# EAGLE schematic node (EAGLE 7.3.0)
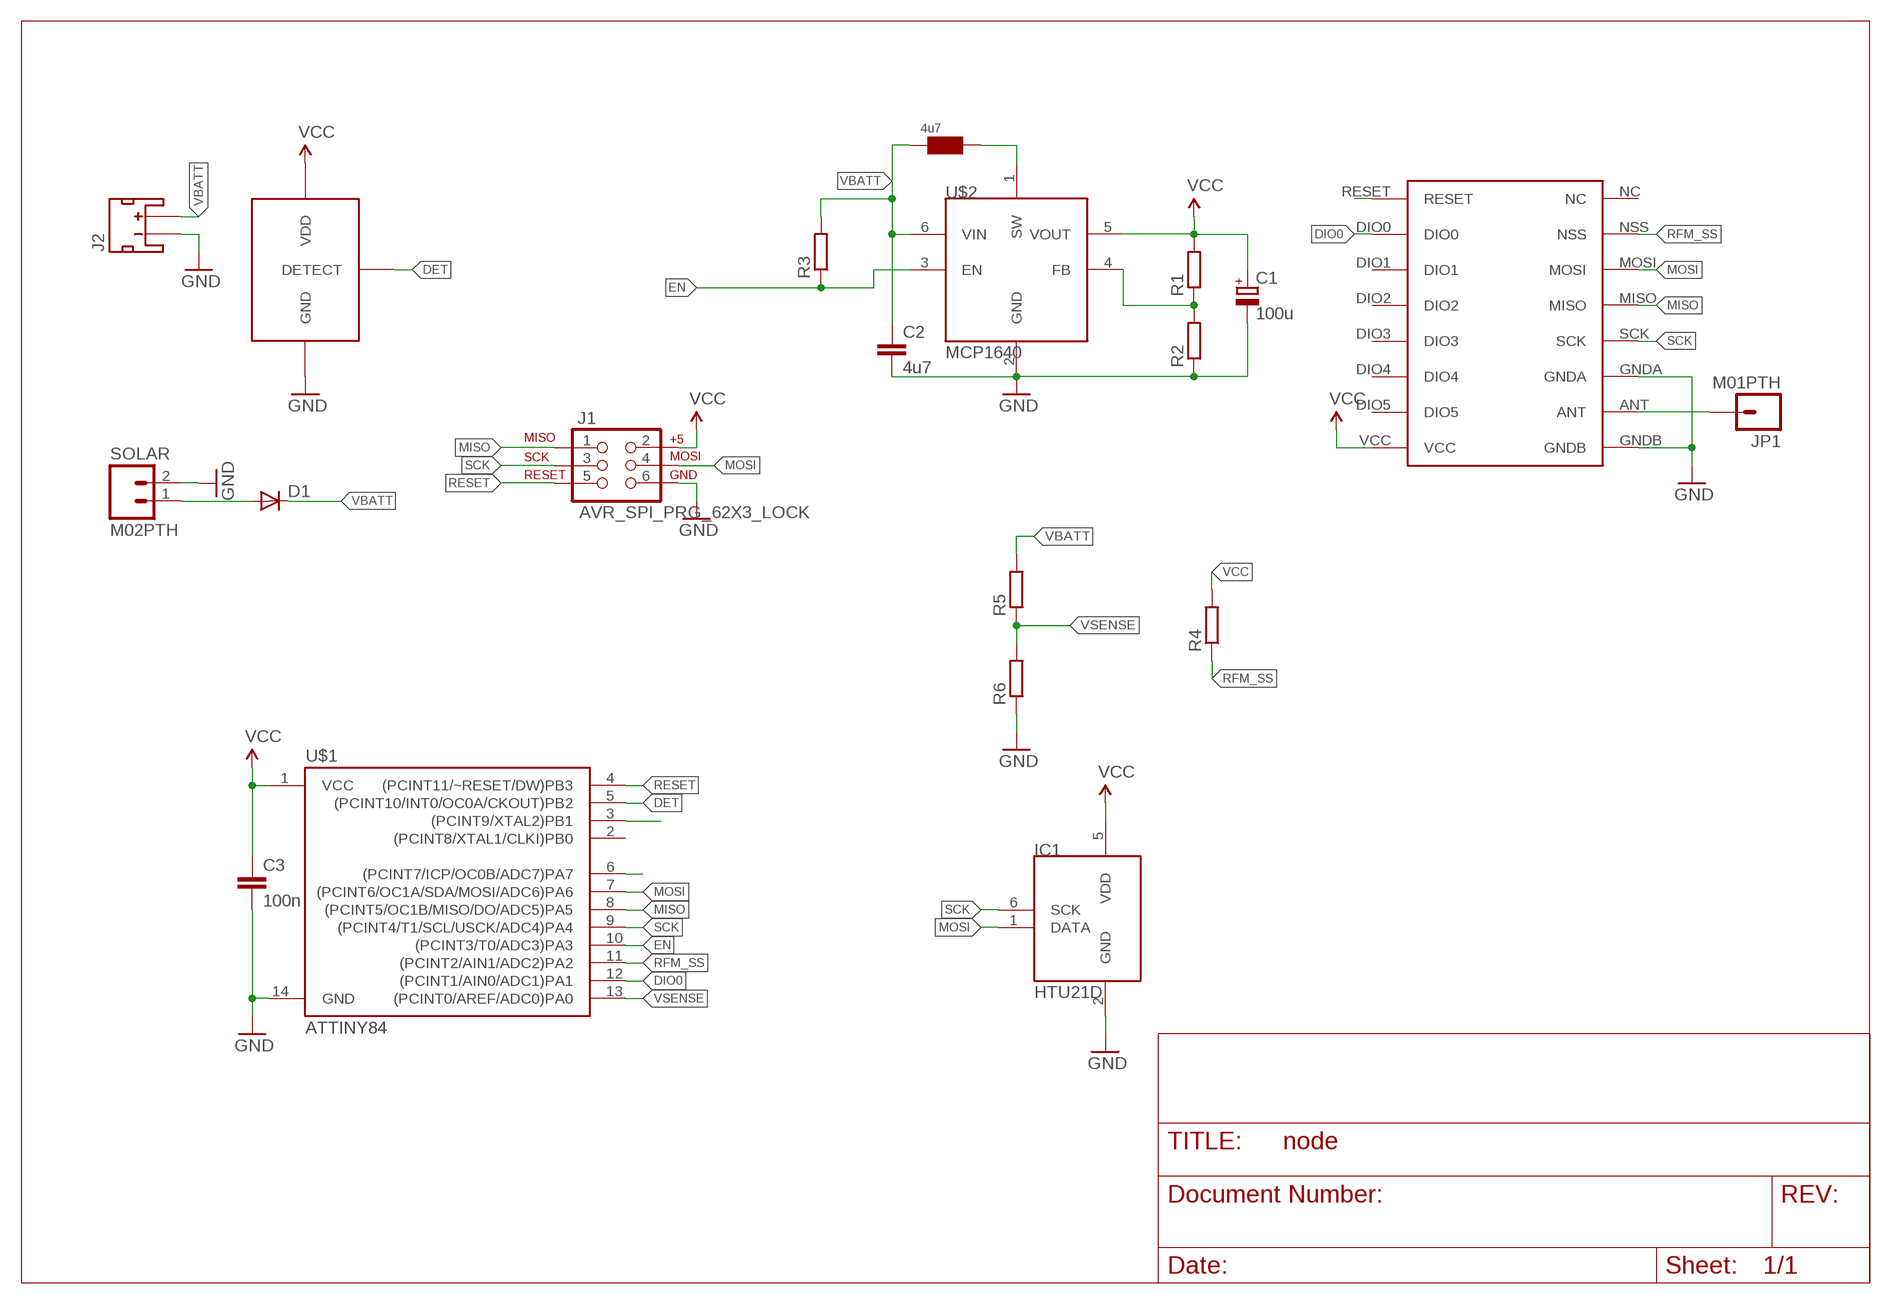
[diagram p0: schematic, sheet 1]

## Parts
C1  100u  CPOL-EUSANYO_SMD_C6  [SANYO-OSCON_SMD_C6]
C2  4u7  C-EUC0603  [C0603]
C3  100n  C-EUC0603  [C0603]
D1  DIODE-SOD123  [SOD123]
DF  4u7  BOURNS_SRN5040  [BOURNS_SRN5040_L]
IC1  HTU21D  [DFN6-L]
J1  AVR_SPI_PRG_62X3_LOCK  [2X3_LOCK]
J2  JST_2MM_MALE_TH  [JST-2-TH]
JP1  M01PTH  [1X01]
R1  R-EU_R0603  [R0603]
R2  R-EU_R0603  [R0603]
R3  R-EU_R0603  [R0603]
R4  R-EU_R0603  [R0603]
R5  R-EU_R0603  [R0603]
R6  R-EU_R0603  [R0603]
SOLAR  M02PTH  [1X02]
U$1  ATTINY84  [SO14]
U$2  MCP1640  [SOT23-6]
U$3  BU49X_VDET_SOT235  [SOT23-5L]
U$4  RFM69HW  [RFM]

## Nets
DET: U$1.5((PCINT10/INT0/OC0A/CKOUT)PB2) U$3.1(DETECT)
DIO0: U$1.12((PCINT1/AIN0/ADC1)PA1) U$4.DIO0
EN: R3.1 U$1.10((PCINT3/T0/ADC3)PA3) U$2.3(EN)
GND: C1.- C2.2 C3.2 IC1.2(GND) J1.6 J2.2(-) R2.1 R6.1 SOLAR.2 U$1.14(GND) U$2.2(GND) U$3.3(GND) U$4.GNDA U$4.GNDB
MISO: J1.1 U$1.8((PCINT5/OC1B/MISO/DO/ADC5)PA5) U$4.MISO
MOSI: IC1.1(DATA) J1.4 U$1.7((PCINT6/OC1A/SDA/MOSI/ADC6)PA6) U$4.MOSI
N$1: DF.P$2 U$2.1(SW)
N$2: R1.1 R2.2 U$2.4(FB)
N$3: JP1.1 U$4.ANT
N$4: U$1.3((PCINT9/XTAL2)PB1)
N$5: D1.A SOLAR.1
N$6: U$1.6((PCINT7/ICP/OC0B/ADC7)PA7)
N$7: U$4.RESET
RESET: J1.5 U$1.4((PCINT11/~RESET/DW)PB3)
RFM_SS: R4.1 U$1.11((PCINT2/AIN1/ADC2)PA2) U$4.NSS
SCK: IC1.6(SCK) J1.3 U$1.9((PCINT4/T1/SCL/USCK/ADC4)PA4) U$4.SCK
VBATT: C2.1 D1.C DF.P$1 J2.1(+) R3.2 R5.2 U$2.6(VIN)
VCC: C1.+ C3.1 IC1.5(VDD) J1.2 R1.2 R4.2 U$1.1(VCC) U$2.5(VOUT) U$3.2(VDD) U$4.VCC
VSENSE: R5.1 R6.2 U$1.13((PCINT0/AREF/ADC0)PA0)
Unconnected: U$1.2((PCINT8/XTAL1/CLKI)PB0) U$4.DIO1 U$4.DIO2 U$4.DIO3 U$4.DIO4 U$4.DIO5 U$4.NC

## Library data of the parts
C1 = rcl:CPOL-EU: POLARIZED CAPACITOR, European symbol
C2 C3 = rcl:C-EU: CAPACITOR, European symbol
D1 = dtb:DIODE-: DIODE
DF = jonsowman:BOURNS_SRN5040
IC1 = Mine:HTU21D
J1 = SparkFun-Connectors:AVR_SPI_PRG_6: AVR ISP 6 Pin This is the reduced ISP connector for AVR programming. Common on Arduino. This footprint will take up less PCB space and can be used with a 10-pin to 6-pin adapter such as SKU: BOB-08508 **Special note about "TEST_POINT" package. The stop mask is on the top side, so if you want your programming test points to be on the bottom of your board, make sure to place this package on the bottom side of the board. This also ensure that the orientation to program from the bottom side will be correct.
J2 = dtb:JST_2MM_MALE_TH: Mates to single-cell LiPo batteries. CONN-08352
JP1 = SparkFun-Connectors:M01: Header 1 Standard 1-pin 0.1" header. Use with straight break away headers (SKU : PRT-00116), right angle break away headers (PRT-00553), swiss pins (PRT-00743), machine pins (PRT-00117), and female headers (PRT-00115).
R1-R6 = rcl:R-EU_: RESISTOR, European symbol
SOLAR = SparkFun-Connectors:M02: Standard 2-pin 0.1" header. Use with - straight break away headers ( PRT-00116) - right angle break away headers (PRT-00553) - swiss pins (PRT-00743) - machine pins (PRT-00117) - female headers (PRT-00115) Molex polarized connector foot print use with: PRT-08233 with associated crimp pins and housings. 2.54_SCREWTERM for use with PRT-10571. 3.5mm Screw Terminal footprints for PRT-08084 5mm Screw Terminal footprints for use with PRT-08432
U$1 = SparkFun-DigitalIC:ATTINY84: Atmel 14-pin 2/4/8kB flash uC; PROD_ID: IC-11285
U$2 = ukhas:MCP1640
U$3 = jonsowman:BU49X_VDET_SOT235
U$4 = hoperf:RFM69HW